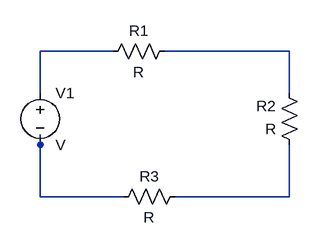
[diagram p0: schematic Voltage_divider.asc]
Voltage_divider.asc, the LTspice schematic file:
Version 4
SHEET 1 880 680
WIRE 272 240 160 240
WIRE 544 240 352 240
WIRE 160 304 160 240
WIRE 544 304 544 240
WIRE 160 384 160 368
WIRE 160 464 160 384
WIRE 288 464 160 464
WIRE 544 464 544 384
WIRE 544 464 368 464
SYMBOL voltage 160 288 R0
SYMATTR InstName V1
SYMBOL res 368 224 R90
WINDOW 0 0 56 VBottom 2
WINDOW 3 32 56 VTop 2
SYMATTR InstName R1
SYMBOL res 560 400 R180
WINDOW 0 36 76 Left 2
WINDOW 3 36 40 Left 2
SYMATTR InstName R2
SYMBOL res 272 480 R270
WINDOW 0 32 56 VTop 2
WINDOW 3 0 56 VBottom 2
SYMATTR InstName R3

The netlist it stands for:
* Voltage_divider.asc
V1 N001 N003 V
R1 N002 N001 R
R2 N004 N002 R
R3 N003 N004 R
.backanno
.end